# EAGLE schematic transmitter_IC (EAGLE 9.6.2)
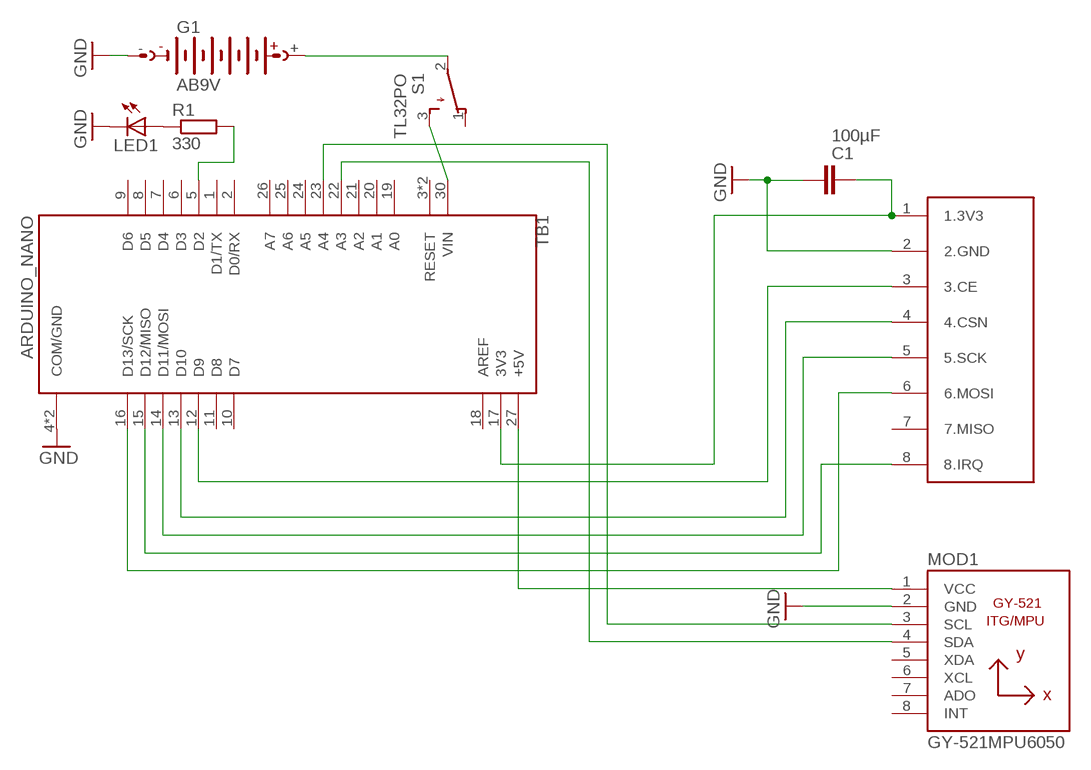
[diagram p0: schematic, sheet 1]

## Parts
C1  100µF  C-EU025-025X050  [C025-025X050]
G1  AB9V  [AB9V]
LED1  LEDSQR2X5  [LED2X5]
MOD1  GY-521MPU6050  [GY-521]
R1  330  R-EU_0207/10  [0207/10]
S1  TL32PO  [TL3XPO]
TB1  ARDUINO_NANO  [SHIELD_ARDUINO_NANO]
U$1  NRF24L01+  [NRF24L01+]

## Nets
GND: C1.2 G1.- LED1.K(C) MOD1.2(GND) TB1.4(COM/GND) TB1.29(COM/GND) U$1.2(2.GND)
N$1: G1.+ S1.2(P)
N$2: S1.3(S) TB1.30(VIN)
N$3: MOD1.1(VCC) TB1.27(+5V)
N$4: MOD1.3(SCL) TB1.23(A4)
N$5: MOD1.4(SDA) TB1.22(A3)
N$6: TB1.12(D9) U$1.3(3.CE)
N$7: C1.1 TB1.17(3V3) U$1.1(1.3V3)
N$8: TB1.13(D10) U$1.4(4.CSN)
N$9: TB1.14(D11/MOSI) U$1.5(5.SCK)
N$10: TB1.15(D12/MISO) U$1.8(8.IRQ)
N$11: TB1.16(D13/SCK) U$1.6(6.MOSI)
N$12: LED1.A R1.1
N$13: R1.2 TB1.5(D2)
Unconnected: MOD1.5(XDA) MOD1.6(XCL) MOD1.7(ADO) MOD1.8(INT) S1.1(O) TB1.1(D1/TX) TB1.2(D0/RX) TB1.3(RESET) TB1.6(D3) TB1.7(D4) TB1.8(D5) TB1.9(D6) TB1.10(D7) TB1.11(D8) TB1.19(A0) TB1.20(A1) TB1.21(A2) TB1.24(A5) TB1.25(A6) TB1.26(A7) TB1.28(RESET) U$1.7(7.MISO)

## Power pins joined to a net without a drawn wire
AREF: TB1.18(AREF)

## Library data of the parts
C1 = rcl:C-EU: CAPACITOR, European symbol; SPICEPREFIX: C
G1 = battery:AB9V: 9-V BATTERY CLIP
LED1 = led:LED: LED OSRAM: - CHIPLED LG R971, LG N971, LY N971, LG Q971, LY Q971, LO R971, LY R971 LH N974, LH R974 LS Q976, LO Q976, LY Q976 LO Q996 - Hyper CHIPLED LW Q18S LB Q993, LB Q99A, LB R99A - SideLED LS A670, LO A670, LY A670, LG A670, LP A670 LB A673, LV A673, LT A673, LW A673 LH A674 LY A675 LS A676, LA A676, LO A676, LY A676, LW A676 LS A679, LY A679, LG A679 - Hyper Micro SIDELED® LS Y876, LA Y876, LO Y876, LY Y876 LT Y87S - SmartLED LW L88C, LW L88S LB L89C, LB L89S, LG L890 LS L89K, LO L89K, LY L89K LS L896, LA L896, LO L896, LY L896 - TOPLED LS T670, LO T670, LY T670, LG T670, LP T670 LSG T670, LSP T670, LSY T670, LOP T670, LYG T670 LG T671, LOG T671, LSG T671 LB T673, LV T673, LT T673, LW T673 LH T674 LS T676, LA T676, LO T676, LY T676, LB T676, LH T676, LSB T676, LW T676 LB T67C, LV T67C, LT T67C, LS T67K, LO T67K, LY T67K, LW E67C LS E67B, LA E67B, LO E67B, LY E67B, LB E67C, LV E67C, LT E67C LW T67C LS T679, LY T679, LG T679 LS T770, LO T770, LY T770, LG T770, LP T770 LB T773, LV T773, LT T773, LW T773 LH T774 LS E675, LA E675, LY E675, LS T675 LS T776, LA T776, LO T776, LY T776, LB T776 LHGB T686 LT T68C, LB T68C - Hyper Mini TOPLED® LB M676 - Mini TOPLED Santana® LG M470 LS M47K, LO M47K, LY M47K Source: http://www.osram.convergy.de LUXEON: - LUMILED® LXK2-PW12-R00, LXK2-PW12-S00, LXK2-PW14-U00, LXK2-PW14-V00 LXK2-PM12-R00, LXK2-PM12-S00, LXK2-PM14-U00 LXK2-PE12-Q00, LXK2-PE12-R00, LXK2-PE12-S00, LXK2-PE14-T00, LXK2-PE14-U00 LXK2-PB12-K00, LXK2-PB12-L00, LXK2-PB12-M00, LXK2-PB14-N00, LXK2-PB14-P00, LXK2-PB14-Q00 LXK2-PR12-L00, LXK2-PR12-M00, LXK2-PR14-Q00, LXK2-PR14-R00 LXK2-PD12-Q00, LXK2-PD12-R00, LXK2-PD12-S00 LXK2-PH12-R00, LXK2-PH12-S00 LXK2-PL12-P00, LXK2-PL12-Q00, LXK2-PL12-R00 Source: www.luxeon.com KINGBRIGHT: KA-3528ASYC Source: www.kingbright.com
MOD1 = GY-521:GY-521: GY-521 PIM for MPU6050 Check availability <https://pricing.snapeda.com/parts/GY-521/GODREAM%20FORDREAM%20CO.%2C%20LIMITED/view-part?ref=eda>; AVAILABILITY: Not in stock; DESCRIPTION: Triple Axis Accelerometer Gyro Breakout; MF: GODREAM FORDREAM CO., LIMITED; MP: GY-521; PACKAGE: Package; PRICE: None
R1 = rcl:R-EU_: RESISTOR, European symbol; SPICEPREFIX: R
S1 = switch:TL32PO: TINY SWITCH ON - MOM Source: http://www2.produktinfo.conrad.com/datenblaetter/700000-724999/705152-da-01-de-Subminiaturschalter_TL_36YO.pdf
TB1 = ARDUINO_NANO:ARDUINO_NANO: Arduino Nano, Through Hole Check availability <https://pricing.snapeda.com/parts/Arduino%20Nano/Arduino/view-part?ref=eda>; AVAILABILITY: Not in stock; DESCRIPTION: Small, complete, and breadboard-friendly board based on the ATmega328 (Arduino Nano 3.x); MF: Arduino; MP: Arduino Nano; PACKAGE: Non-Standard Arduino; PRICE: None
U$1 = NRF24L01:NRF24L01+